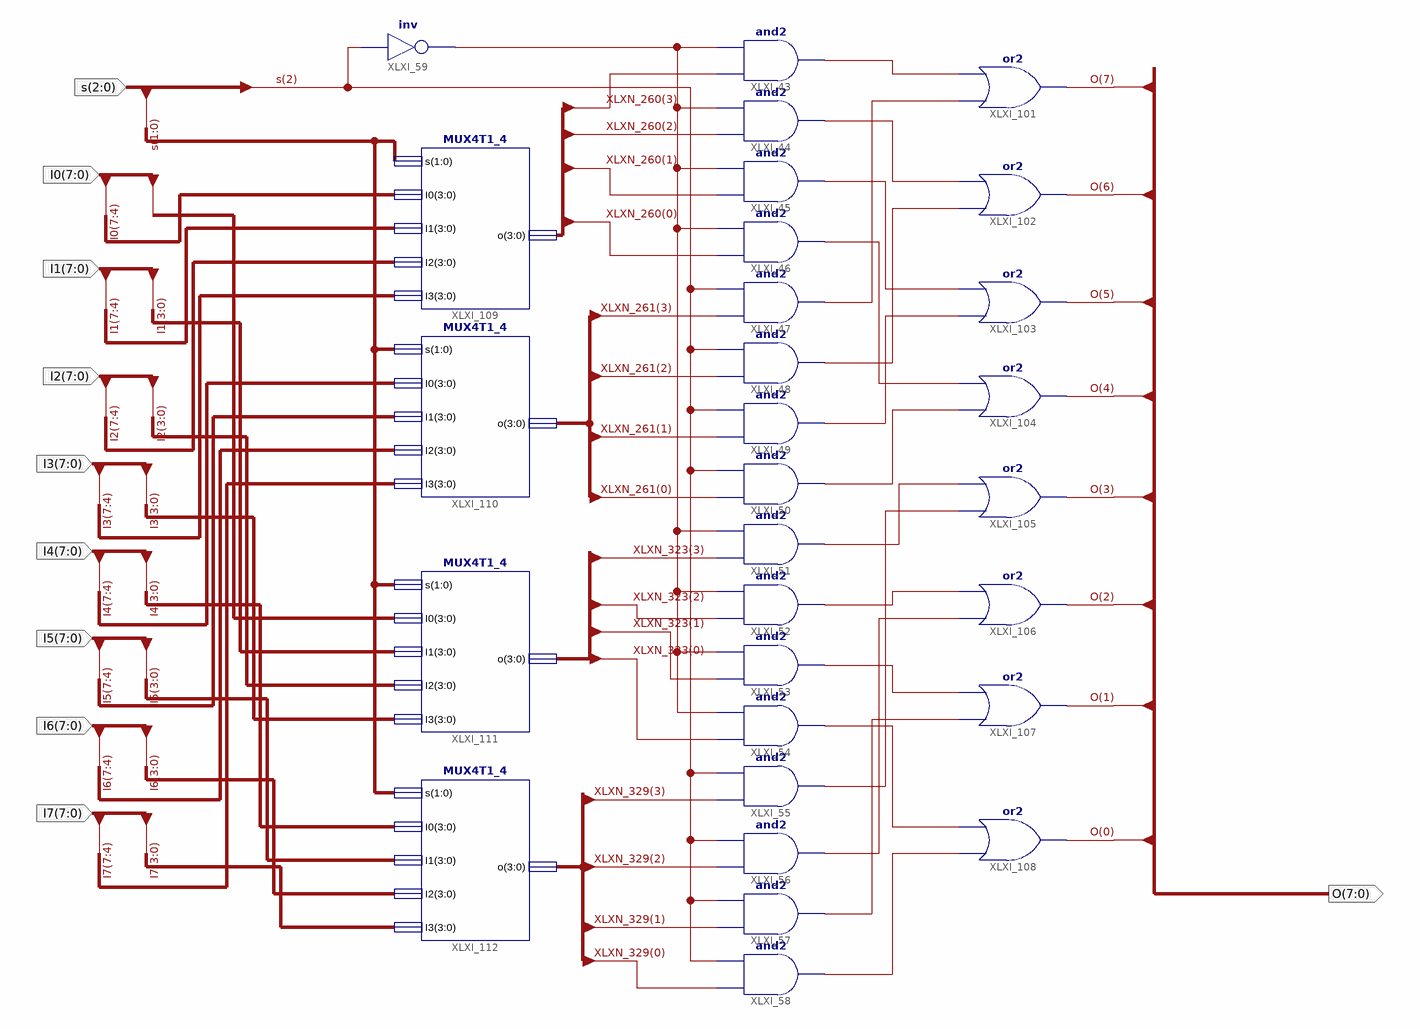
[diagram p0: schematic sheet 1]
// Xilinx ISE schematic MUX8T1_8.sch (kintex7) as structural Verilog: 29 symbols, 10 ports
module MUX8T1_8 (
  input  [7:0] I7,
  input  [7:0] I6,
  input  [7:0] I5,
  input  [7:0] I4,
  input  [7:0] I3,
  input  [7:0] I2,
  input  [7:0] I1,
  input  [7:0] I0,
  input  [2:0] s,
  output [7:0] O
);

  wire XLXN_246, XLXN_292, XLXN_293, XLXN_294, XLXN_295, XLXN_296, XLXN_297, XLXN_298, XLXN_299, XLXN_300,
       XLXN_301, XLXN_302, XLXN_304, XLXN_305, XLXN_306, XLXN_307, XLXN_308;
  wire [3:0] XLXN_260, XLXN_261, XLXN_323, XLXN_329;

  MUX4T1_4 XLXI_111 (.I3(I3[3:0]), .s(s[1:0]), .I2(I2[3:0]), .I1(I1[3:0]), .I0(I0[3:0]), .o(XLXN_323));
  MUX4T1_4 XLXI_112 (.I3(I7[3:0]), .s(s[1:0]), .I2(I6[3:0]), .I1(I5[3:0]), .I0(I4[3:0]), .o(XLXN_329));
  MUX4T1_4 XLXI_110 (.I3(I7[7:4]), .s(s[1:0]), .I2(I6[7:4]), .I1(I5[7:4]), .I0(I4[7:4]), .o(XLXN_261));
  MUX4T1_4 XLXI_109 (.I3(I3[7:4]), .s(s[1:0]), .I2(I2[7:4]), .I1(I1[7:4]), .I0(I0[7:4]), .o(XLXN_260));
  or XLXI_108 (O[0], XLXN_308, XLXN_304);
  or XLXI_107 (O[1], XLXN_307, XLXN_302);
  or XLXI_106 (O[2], XLXN_306, XLXN_301);
  or XLXI_105 (O[3], XLXN_305, XLXN_300);
  or XLXI_104 (O[4], XLXN_299, XLXN_295);
  or XLXI_103 (O[5], XLXN_298, XLXN_294);
  or XLXI_102 (O[6], XLXN_297, XLXN_293);
  or XLXI_101 (O[7], XLXN_296, XLXN_292);
  and XLXI_58 (XLXN_308, XLXN_329[0], s[2]);
  and XLXI_57 (XLXN_307, XLXN_329[1], s[2]);
  and XLXI_56 (XLXN_306, XLXN_329[2], s[2]);
  and XLXI_55 (XLXN_305, XLXN_329[3], s[2]);
  and XLXI_54 (XLXN_304, XLXN_323[0], XLXN_246);
  and XLXI_53 (XLXN_302, XLXN_323[1], XLXN_246);
  and XLXI_52 (XLXN_301, XLXN_323[2], XLXN_246);
  and XLXI_51 (XLXN_300, XLXN_323[3], XLXN_246);
  and XLXI_50 (XLXN_299, XLXN_261[0], s[2]);
  and XLXI_49 (XLXN_298, XLXN_261[1], s[2]);
  and XLXI_48 (XLXN_297, XLXN_261[2], s[2]);
  and XLXI_47 (XLXN_296, XLXN_261[3], s[2]);
  and XLXI_46 (XLXN_295, XLXN_260[0], XLXN_246);
  and XLXI_45 (XLXN_294, XLXN_260[1], XLXN_246);
  and XLXI_44 (XLXN_293, XLXN_260[2], XLXN_246);
  and XLXI_43 (XLXN_292, XLXN_260[3], XLXN_246);
  not XLXI_59 (XLXN_246, s[2]);
endmodule
